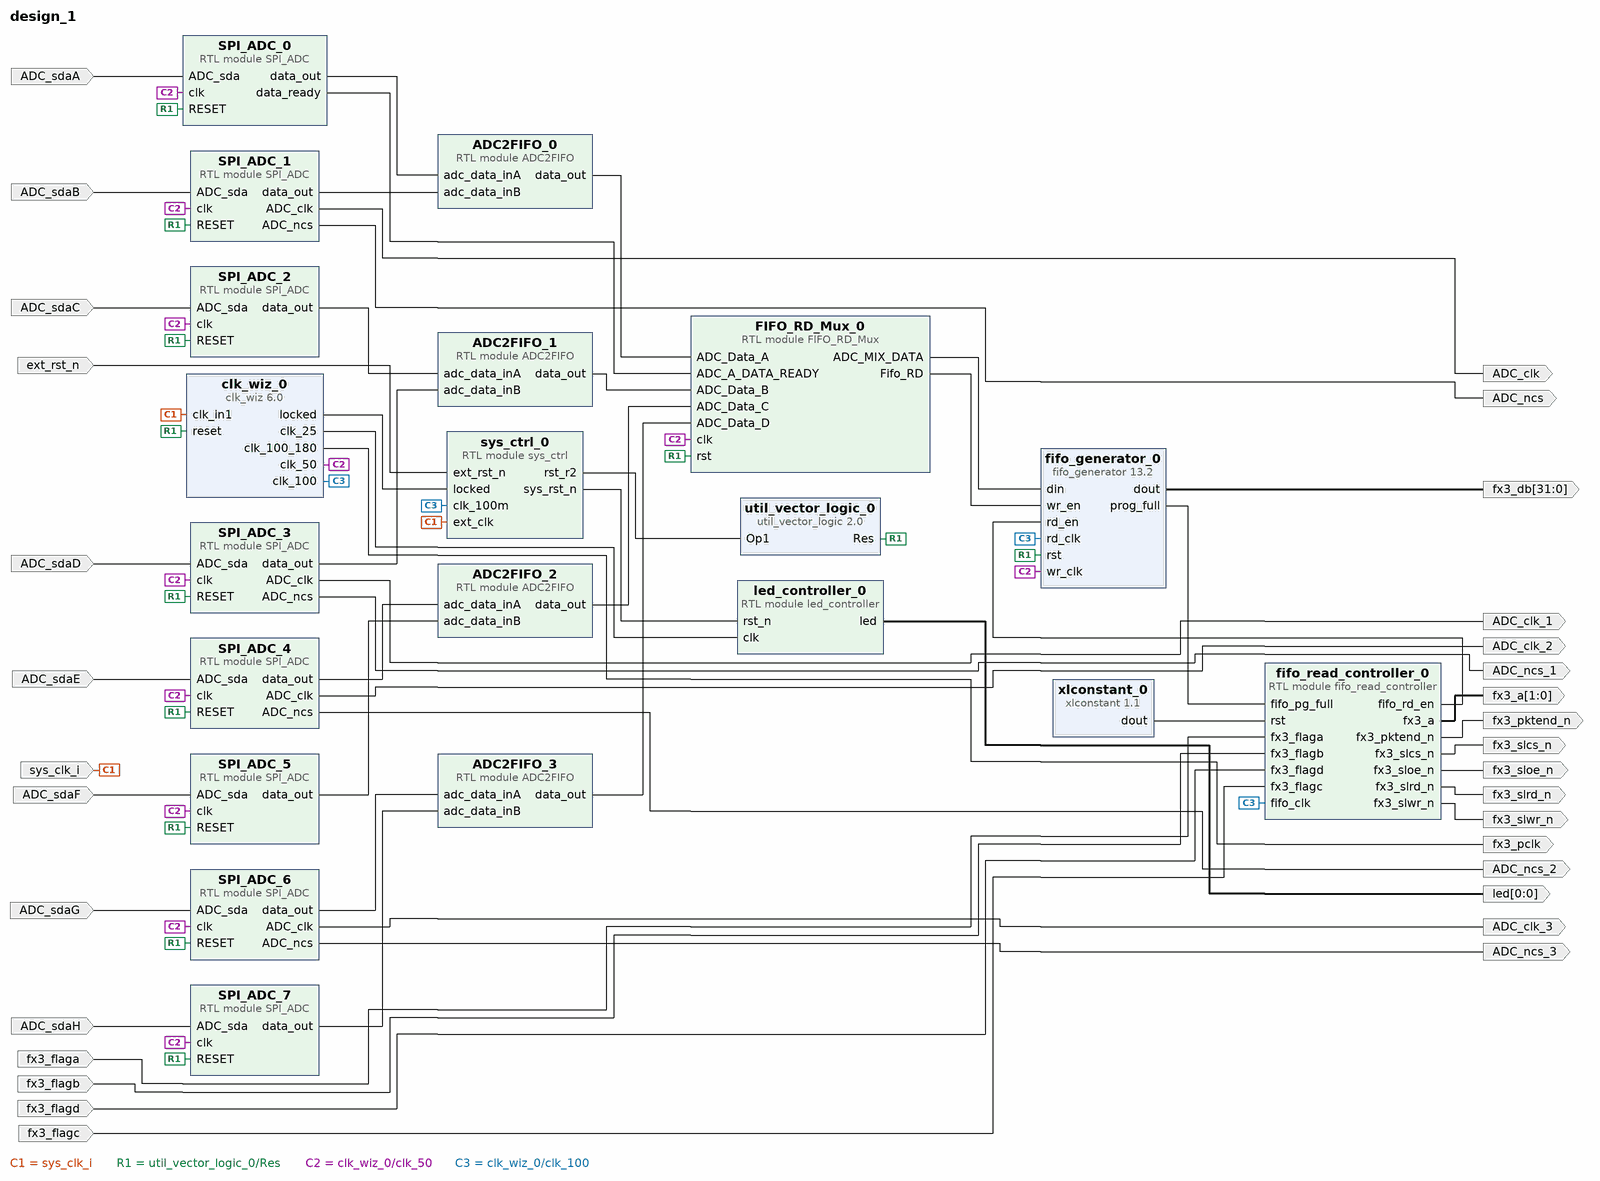
[diagram p0: block diagram of the top level]
# Vivado block design design_1, xc7a35tftg256-1, Vivado 2018.1
create_bd_design design_1

create_bd_port -dir I sys_clk_i
create_bd_port -dir I ext_rst_n
create_bd_port -dir O -from 0 -to 0 -type data led
create_bd_port -dir I fx3_flaga
create_bd_port -dir O fx3_pclk
create_bd_port -dir O -from 31 -to 0 fx3_db
create_bd_port -dir O -from 1 -to 0 fx3_a
create_bd_port -dir O fx3_pktend_n
create_bd_port -dir O fx3_sloe_n
create_bd_port -dir O fx3_slrd_n
create_bd_port -dir O fx3_slwr_n
create_bd_port -dir O fx3_slcs_n
create_bd_port -dir I fx3_flagb
create_bd_port -dir I fx3_flagd
create_bd_port -dir I fx3_flagc
create_bd_port -dir I ADC_sdaA
create_bd_port -dir I ADC_sdaB
create_bd_port -dir O -type clk ADC_clk
create_bd_port -dir O ADC_ncs
create_bd_port -dir I ADC_sdaC
create_bd_port -dir I ADC_sdaD
create_bd_port -dir I ADC_sdaE
create_bd_port -dir I ADC_sdaF
create_bd_port -dir I ADC_sdaG
create_bd_port -dir I ADC_sdaH
create_bd_port -dir O -type clk ADC_clk_1
create_bd_port -dir O ADC_ncs_1
create_bd_port -dir O -type clk ADC_clk_2
create_bd_port -dir O ADC_ncs_2
create_bd_port -dir O -type clk ADC_clk_3
create_bd_port -dir O ADC_ncs_3

create_bd_cell -type ip -vlnv xilinx.com:ip:clk_wiz:6.0 clk_wiz_0
set_property -dict [list \
  CONFIG.PRIM_IN_FREQ 50 \
  CONFIG.CLKIN1_JITTER_PS 200.0 \
  CONFIG.CLKOUT2_USED true \
  CONFIG.CLKOUT3_USED true \
  CONFIG.CLKOUT4_USED true \
  CONFIG.CLKOUT5_USED true \
  CONFIG.NUM_OUT_CLKS 5 \
  CONFIG.CLK_OUT1_PORT clk_25 \
  CONFIG.CLK_OUT2_PORT clk_50 \
  CONFIG.CLK_OUT3_PORT clk_100 \
  CONFIG.CLK_OUT4_PORT clk_400 \
  CONFIG.CLK_OUT5_PORT clk_100_180 \
  CONFIG.CLKOUT1_REQUESTED_OUT_FREQ 25 \
  CONFIG.CLKOUT2_REQUESTED_OUT_FREQ 70 \
  CONFIG.CLKOUT4_REQUESTED_OUT_FREQ 400 \
  CONFIG.CLKOUT5_REQUESTED_PHASE 180 \
  CONFIG.OVERRIDE_MMCM false \
  CONFIG.MMCM_DIVCLK_DIVIDE 1 \
  CONFIG.MMCM_CLKFBOUT_MULT_F 14.000 \
  CONFIG.MMCM_CLKIN1_PERIOD 20.000 \
  CONFIG.MMCM_CLKIN2_PERIOD 10.0 \
  CONFIG.MMCM_CLKOUT0_DIVIDE_F 28.000 \
  CONFIG.MMCM_CLKOUT1_DIVIDE 10 \
  CONFIG.MMCM_CLKOUT2_DIVIDE 7 \
  CONFIG.MMCM_CLKOUT3_DIVIDE 2 \
  CONFIG.MMCM_CLKOUT4_DIVIDE 7 \
  CONFIG.MMCM_CLKOUT4_PHASE 180.000 \
  CONFIG.CLKOUT1_JITTER 273.862 \
  CONFIG.CLKOUT1_PHASE_ERROR 143.018 \
  CONFIG.CLKOUT2_JITTER 219.770 \
  CONFIG.CLKOUT2_PHASE_ERROR 143.018 \
  CONFIG.CLKOUT3_JITTER 201.513 \
  CONFIG.CLKOUT3_PHASE_ERROR 143.018 \
  CONFIG.CLKOUT4_JITTER 158.040 \
  CONFIG.CLKOUT4_PHASE_ERROR 143.018 \
  CONFIG.CLKOUT5_JITTER 201.513 \
  CONFIG.CLKOUT5_PHASE_ERROR 143.018 \
] [get_bd_cells clk_wiz_0]
create_bd_cell -type ip -vlnv xilinx.com:ip:util_vector_logic:2.0 util_vector_logic_0
set_property -dict {CONFIG.C_SIZE 1 CONFIG.C_OPERATION not} [get_bd_cells util_vector_logic_0]
create_bd_cell -type ip -vlnv xilinx.com:ip:fifo_generator:13.2 fifo_generator_0
set_property -dict [list \
  CONFIG.Fifo_Implementation Independent_Clocks_Block_RAM \
  CONFIG.Performance_Options First_Word_Fall_Through \
  CONFIG.Input_Data_Width 32 \
  CONFIG.Input_Depth 512 \
  CONFIG.Output_Data_Width 32 \
  CONFIG.Enable_ECC false \
  CONFIG.Reset_Pin true \
  CONFIG.Full_Flags_Reset_Value 1 \
  CONFIG.Use_Dout_Reset true \
  CONFIG.Valid_Flag false \
  CONFIG.Write_Data_Count true \
  CONFIG.Write_Data_Count_Width 9 \
  CONFIG.Read_Data_Count true \
  CONFIG.Read_Data_Count_Width 9 \
  CONFIG.Programmable_Full_Type Multiple_Programmable_Full_Threshold_Constants \
  CONFIG.Full_Threshold_Assert_Value 384 \
  CONFIG.Full_Threshold_Negate_Value 383 \
  CONFIG.Enable_Safety_Circuit true \
] [get_bd_cells fifo_generator_0]
create_bd_cell -type ip -vlnv xilinx.com:ip:xlconstant:1.1 xlconstant_0
set_property -dict {CONFIG.CONST_VAL 0} [get_bd_cells xlconstant_0]
create_bd_cell -type module -reference SPI_ADC SPI_ADC_0
set_property -dict {CONFIG.ACQ_cycle 4 CONFIG.Period_cycle 20 CONFIG.Data_delay_cycle 2} [get_bd_cells SPI_ADC_0]
create_bd_cell -type module -reference SPI_ADC SPI_ADC_1
set_property -dict {CONFIG.ACQ_cycle 4 CONFIG.Period_cycle 20 CONFIG.Data_delay_cycle 2} [get_bd_cells SPI_ADC_1]
create_bd_cell -type module -reference SPI_ADC SPI_ADC_2
set_property -dict {CONFIG.ACQ_cycle 4 CONFIG.Period_cycle 20 CONFIG.Data_delay_cycle 2 CONFIG.FIFO_nr 2} [get_bd_cells SPI_ADC_2]
create_bd_cell -type module -reference SPI_ADC SPI_ADC_3
set_property -dict {CONFIG.ACQ_cycle 4 CONFIG.Period_cycle 20 CONFIG.Data_delay_cycle 2 CONFIG.FIFO_nr 2} [get_bd_cells SPI_ADC_3]
create_bd_cell -type module -reference SPI_ADC SPI_ADC_4
set_property -dict {CONFIG.ACQ_cycle 4 CONFIG.Period_cycle 20 CONFIG.Data_delay_cycle 2 CONFIG.FIFO_nr 3} [get_bd_cells SPI_ADC_4]
create_bd_cell -type module -reference SPI_ADC SPI_ADC_5
set_property -dict {CONFIG.ACQ_cycle 4 CONFIG.Period_cycle 20 CONFIG.Data_delay_cycle 2 CONFIG.FIFO_nr 3} [get_bd_cells SPI_ADC_5]
create_bd_cell -type module -reference SPI_ADC SPI_ADC_6
set_property -dict {CONFIG.ACQ_cycle 4 CONFIG.Period_cycle 20 CONFIG.Data_delay_cycle 2 CONFIG.FIFO_nr 4} [get_bd_cells SPI_ADC_6]
create_bd_cell -type module -reference SPI_ADC SPI_ADC_7
set_property -dict {CONFIG.ACQ_cycle 4 CONFIG.Period_cycle 20 CONFIG.Data_delay_cycle 2 CONFIG.FIFO_nr 4} [get_bd_cells SPI_ADC_7]
create_bd_cell -type module -reference FIFO_RD_Mux FIFO_RD_Mux_0
create_bd_cell -type module -reference ADC2FIFO ADC2FIFO_0
create_bd_cell -type module -reference ADC2FIFO ADC2FIFO_1
create_bd_cell -type module -reference ADC2FIFO ADC2FIFO_2
create_bd_cell -type module -reference ADC2FIFO ADC2FIFO_3
create_bd_cell -type module -reference sys_ctrl sys_ctrl_0
create_bd_cell -type module -reference fifo_read_controller fifo_read_controller_0
create_bd_cell -type module -reference led_controller led_controller_0

# ---- connections ----

connect_bd_net [get_bd_ports sys_clk_i] [get_bd_pins clk_wiz_0/clk_in1] [get_bd_pins sys_ctrl_0/ext_clk]
connect_bd_net [get_bd_pins sys_ctrl_0/rst_r2] [get_bd_pins util_vector_logic_0/Op1]
connect_bd_net [get_bd_pins util_vector_logic_0/Res] \
  [get_bd_pins clk_wiz_0/reset] [get_bd_pins SPI_ADC_0/RESET] [get_bd_pins SPI_ADC_1/RESET] [get_bd_pins SPI_ADC_2/RESET] \
  [get_bd_pins SPI_ADC_3/RESET] [get_bd_pins SPI_ADC_4/RESET] [get_bd_pins SPI_ADC_5/RESET] [get_bd_pins SPI_ADC_6/RESET] \
  [get_bd_pins SPI_ADC_7/RESET] [get_bd_pins fifo_generator_0/rst] [get_bd_pins FIFO_RD_Mux_0/rst]
connect_bd_net [get_bd_ports ext_rst_n] [get_bd_pins sys_ctrl_0/ext_rst_n]
connect_bd_net [get_bd_pins led_controller_0/led] [get_bd_ports led]
connect_bd_net [get_bd_pins clk_wiz_0/locked] [get_bd_pins sys_ctrl_0/locked]
connect_bd_net [get_bd_pins sys_ctrl_0/sys_rst_n] [get_bd_pins led_controller_0/rst_n]
connect_bd_net [get_bd_ports fx3_flaga] [get_bd_pins fifo_read_controller_0/fx3_flaga]
connect_bd_net [get_bd_pins clk_wiz_0/clk_100_180] [get_bd_ports fx3_pclk]
connect_bd_net [get_bd_pins clk_wiz_0/clk_50] \
  [get_bd_pins fifo_generator_0/wr_clk] [get_bd_pins SPI_ADC_0/clk] [get_bd_pins SPI_ADC_1/clk] [get_bd_pins SPI_ADC_2/clk] \
  [get_bd_pins SPI_ADC_3/clk] [get_bd_pins SPI_ADC_4/clk] [get_bd_pins SPI_ADC_5/clk] [get_bd_pins SPI_ADC_6/clk] \
  [get_bd_pins SPI_ADC_7/clk] [get_bd_pins FIFO_RD_Mux_0/clk]
connect_bd_net [get_bd_pins clk_wiz_0/clk_100] \
  [get_bd_pins fifo_generator_0/rd_clk] [get_bd_pins sys_ctrl_0/clk_100m] [get_bd_pins fifo_read_controller_0/fifo_clk]
connect_bd_net [get_bd_pins fifo_generator_0/prog_full] [get_bd_pins fifo_read_controller_0/fifo_pg_full]
connect_bd_net [get_bd_pins fifo_read_controller_0/fifo_rd_en] [get_bd_pins fifo_generator_0/rd_en]
connect_bd_net [get_bd_pins xlconstant_0/dout] [get_bd_pins fifo_read_controller_0/rst]
connect_bd_net [get_bd_pins fifo_generator_0/dout] [get_bd_ports fx3_db]
connect_bd_net [get_bd_pins fifo_read_controller_0/fx3_a] [get_bd_ports fx3_a]
connect_bd_net [get_bd_pins fifo_read_controller_0/fx3_pktend_n] [get_bd_ports fx3_pktend_n]
connect_bd_net [get_bd_pins fifo_read_controller_0/fx3_sloe_n] [get_bd_ports fx3_sloe_n]
connect_bd_net [get_bd_pins fifo_read_controller_0/fx3_slrd_n] [get_bd_ports fx3_slrd_n]
connect_bd_net [get_bd_pins fifo_read_controller_0/fx3_slwr_n] [get_bd_ports fx3_slwr_n]
connect_bd_net [get_bd_pins fifo_read_controller_0/fx3_slcs_n] [get_bd_ports fx3_slcs_n]
connect_bd_net [get_bd_ports fx3_flagb] [get_bd_pins fifo_read_controller_0/fx3_flagb]
connect_bd_net [get_bd_ports fx3_flagd] [get_bd_pins fifo_read_controller_0/fx3_flagd]
connect_bd_net [get_bd_ports fx3_flagc] [get_bd_pins fifo_read_controller_0/fx3_flagc]
connect_bd_net [get_bd_ports ADC_sdaA] [get_bd_pins SPI_ADC_0/ADC_sda]
connect_bd_net [get_bd_ports ADC_sdaB] [get_bd_pins SPI_ADC_1/ADC_sda]
connect_bd_net [get_bd_pins SPI_ADC_0/data_out] [get_bd_pins ADC2FIFO_0/adc_data_inA]
connect_bd_net [get_bd_pins SPI_ADC_1/data_out] [get_bd_pins ADC2FIFO_0/adc_data_inB]
connect_bd_net [get_bd_pins SPI_ADC_1/ADC_clk] [get_bd_ports ADC_clk]
connect_bd_net [get_bd_pins SPI_ADC_1/ADC_ncs] [get_bd_ports ADC_ncs]
connect_bd_net [get_bd_pins FIFO_RD_Mux_0/ADC_MIX_DATA] [get_bd_pins fifo_generator_0/din]
connect_bd_net [get_bd_pins FIFO_RD_Mux_0/Fifo_RD] [get_bd_pins fifo_generator_0/wr_en]
connect_bd_net [get_bd_pins SPI_ADC_2/data_out] [get_bd_pins ADC2FIFO_1/adc_data_inA]
connect_bd_net [get_bd_pins SPI_ADC_3/data_out] [get_bd_pins ADC2FIFO_1/adc_data_inB]
connect_bd_net [get_bd_pins SPI_ADC_4/data_out] [get_bd_pins ADC2FIFO_2/adc_data_inA]
connect_bd_net [get_bd_pins SPI_ADC_5/data_out] [get_bd_pins ADC2FIFO_2/adc_data_inB]
connect_bd_net [get_bd_pins SPI_ADC_6/data_out] [get_bd_pins ADC2FIFO_3/adc_data_inA]
connect_bd_net [get_bd_pins SPI_ADC_7/data_out] [get_bd_pins ADC2FIFO_3/adc_data_inB]
connect_bd_net [get_bd_pins ADC2FIFO_3/data_out] [get_bd_pins FIFO_RD_Mux_0/ADC_Data_D]
connect_bd_net [get_bd_pins SPI_ADC_0/data_ready] [get_bd_pins FIFO_RD_Mux_0/ADC_A_DATA_READY]
connect_bd_net [get_bd_ports ADC_sdaC] [get_bd_pins SPI_ADC_2/ADC_sda]
connect_bd_net [get_bd_ports ADC_sdaD] [get_bd_pins SPI_ADC_3/ADC_sda]
connect_bd_net [get_bd_ports ADC_sdaE] [get_bd_pins SPI_ADC_4/ADC_sda]
connect_bd_net [get_bd_ports ADC_sdaF] [get_bd_pins SPI_ADC_5/ADC_sda]
connect_bd_net [get_bd_ports ADC_sdaG] [get_bd_pins SPI_ADC_6/ADC_sda]
connect_bd_net [get_bd_ports ADC_sdaH] [get_bd_pins SPI_ADC_7/ADC_sda]
connect_bd_net [get_bd_pins SPI_ADC_3/ADC_clk] [get_bd_ports ADC_clk_1]
connect_bd_net [get_bd_pins SPI_ADC_3/ADC_ncs] [get_bd_ports ADC_ncs_1]
connect_bd_net [get_bd_pins SPI_ADC_4/ADC_clk] [get_bd_ports ADC_clk_2]
connect_bd_net [get_bd_pins SPI_ADC_4/ADC_ncs] [get_bd_ports ADC_ncs_2]
connect_bd_net [get_bd_pins SPI_ADC_6/ADC_clk] [get_bd_ports ADC_clk_3]
connect_bd_net [get_bd_pins SPI_ADC_6/ADC_ncs] [get_bd_ports ADC_ncs_3]
connect_bd_net [get_bd_pins clk_wiz_0/clk_25] [get_bd_pins led_controller_0/clk]
connect_bd_net [get_bd_pins ADC2FIFO_2/data_out] [get_bd_pins FIFO_RD_Mux_0/ADC_Data_C]
connect_bd_net [get_bd_pins ADC2FIFO_1/data_out] [get_bd_pins FIFO_RD_Mux_0/ADC_Data_B]
connect_bd_net [get_bd_pins ADC2FIFO_0/data_out] [get_bd_pins FIFO_RD_Mux_0/ADC_Data_A]

validate_bd_design
save_bd_design
